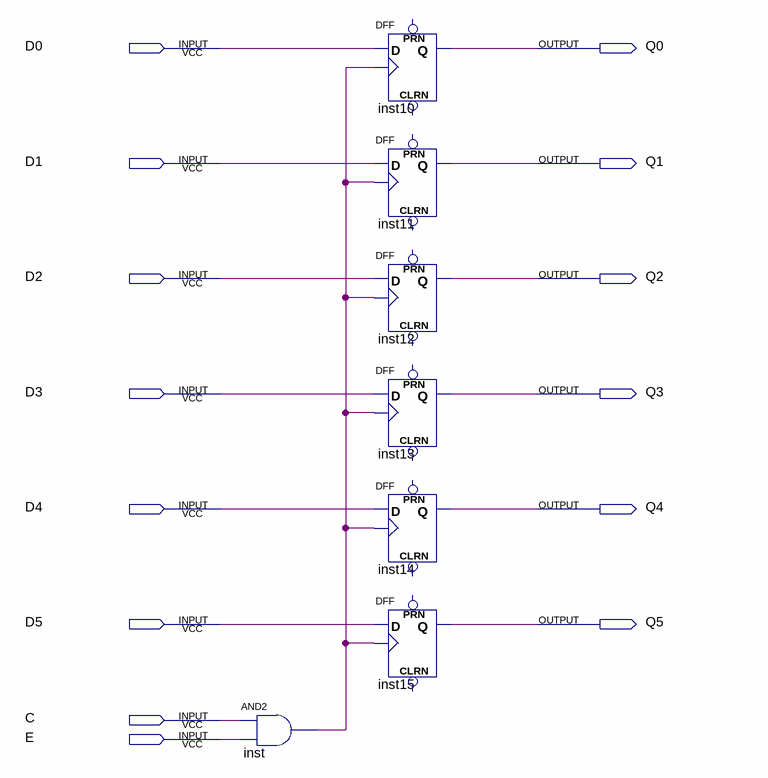
[diagram p0: schematic sheet]
// Quartus schematic lab1.bdf as structural Verilog: 7 symbols, 14 pins
module lab1 (
  input  D0,
  input  D1,
  input  D2,
  input  D3,
  input  D4,
  input  D5,
  input  C,
  input  E,
  output Q0,
  output Q1,
  output Q2,
  output Q3,
  output Q4,
  output Q5
);

  wire inst_out;

  and inst (inst_out, C, E);
  DFF inst10 (.CLK(inst_out), .D(D0), .Q(Q0));  // open: CLRN, PRN
  DFF inst11 (.CLK(inst_out), .D(D1), .Q(Q1));  // open: CLRN, PRN
  DFF inst12 (.CLK(inst_out), .D(D2), .Q(Q2));  // open: CLRN, PRN
  DFF inst13 (.CLK(inst_out), .D(D3), .Q(Q3));  // open: CLRN, PRN
  DFF inst14 (.CLK(inst_out), .D(D4), .Q(Q4));  // open: CLRN, PRN
  DFF inst15 (.CLK(inst_out), .D(D5), .Q(Q5));  // open: CLRN, PRN
endmodule
